# EAGLE design tesla_b (EAGLE 9.6.2)
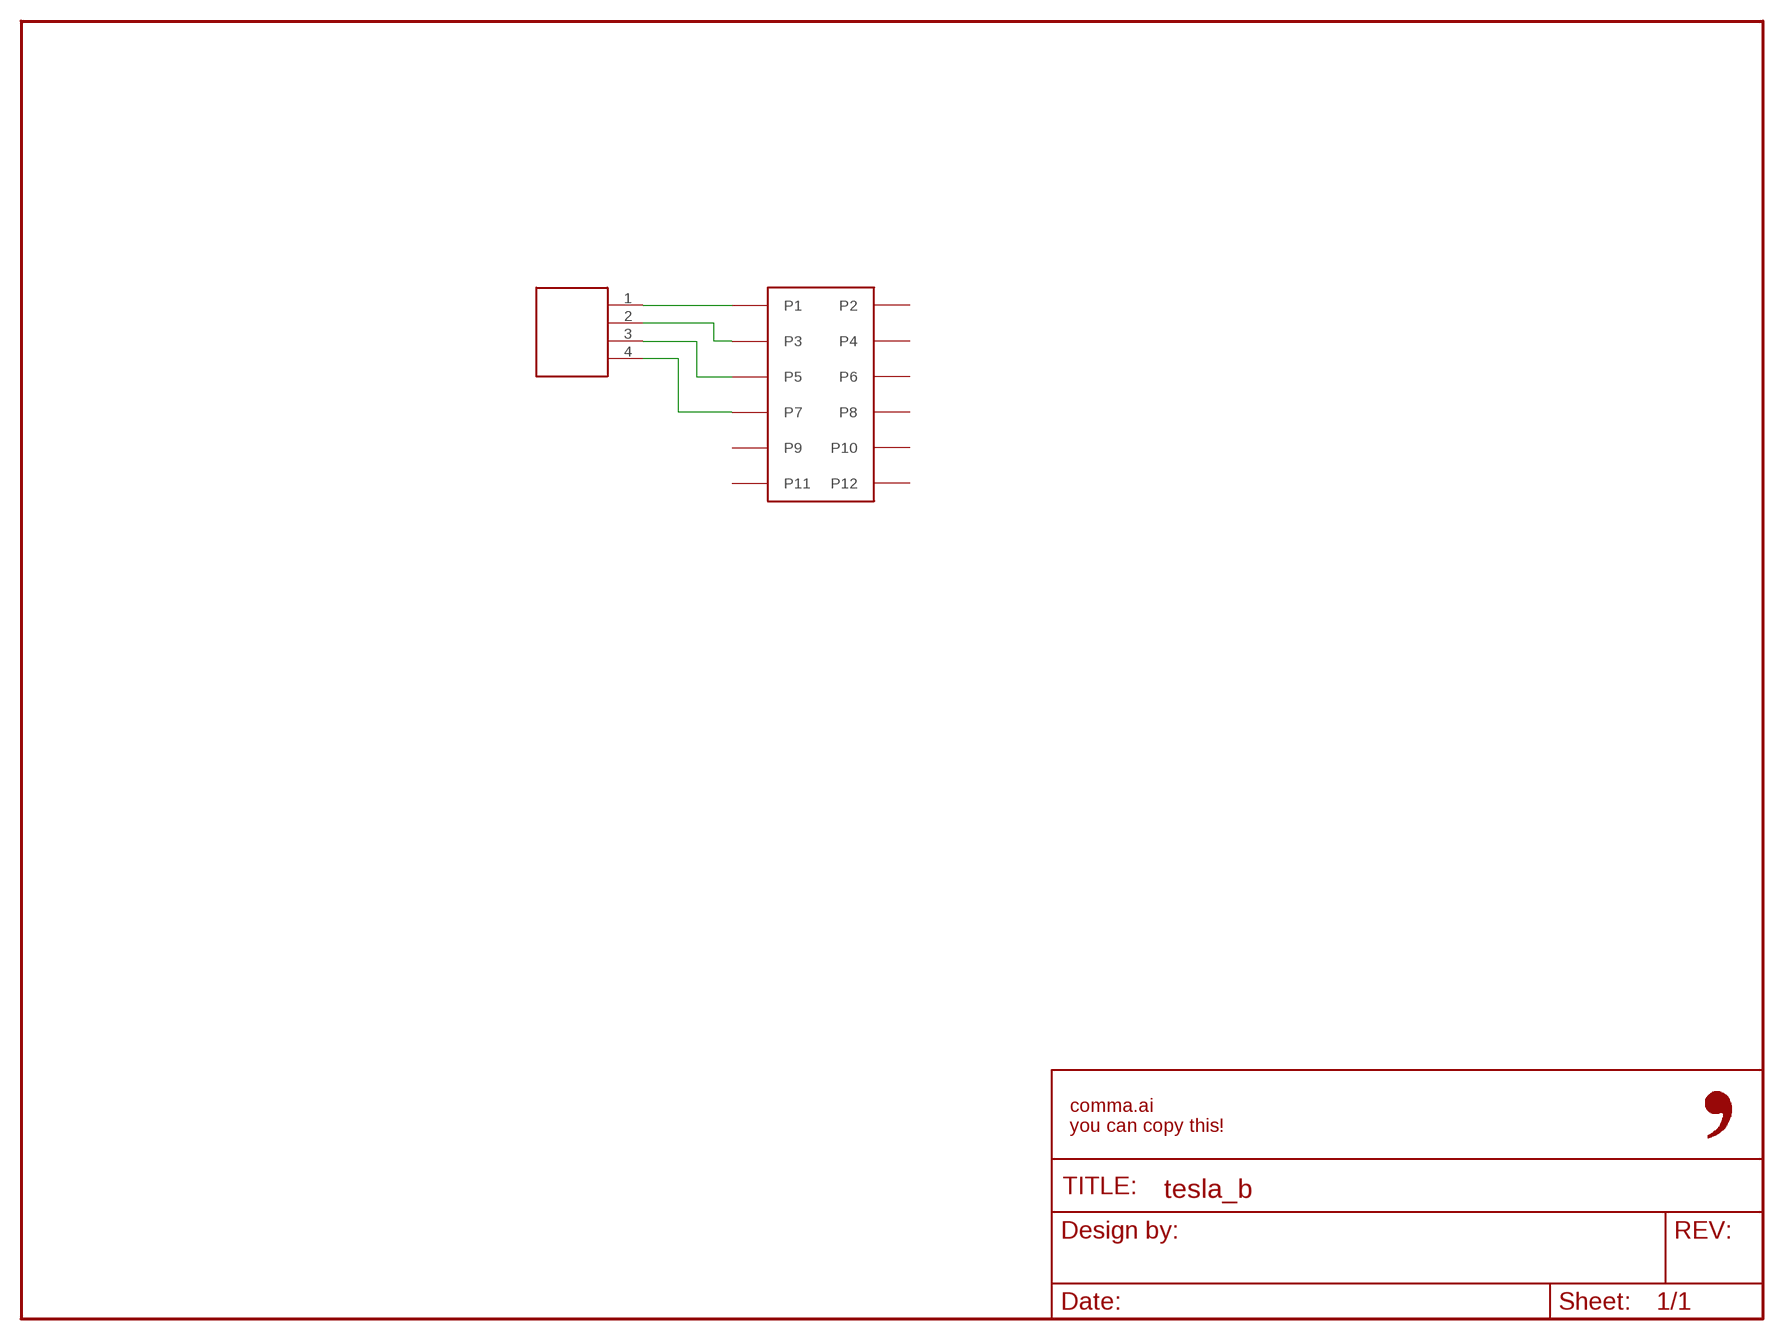
[diagram p0: schematic, sheet 1]

## Parts
FRAME1  FRAME-LETTER-OPENNO_PACKAGE  [DUMMY]
J1  5016451220  [5016451220]
J2  M04-641211-4  [641211-4]

## Nets
N$1: J1.P1 J2.1
N$2: J1.P3 J2.2
N$3: J1.P5 J2.3
N$4: J1.P7 J2.4
Unconnected: J1.P2 J1.P4 J1.P6 J1.P8 J1.P9 J1.P10 J1.P11 J1.P12

## Library data of the parts
FRAME1 = comma.ai:FRAME-LETTER-OPEN: Schematic Frame - Letter Standard 8.5x11 US Letter frame; DESIGNER: Nobody; VERSION: v01
J1 = comma.ai:5016451220; CPN: CAI-501645-1220
J2 = comma.ai:M04; CPN: CAI-2.54-4-HEADER-WIDE-BASE

## Board
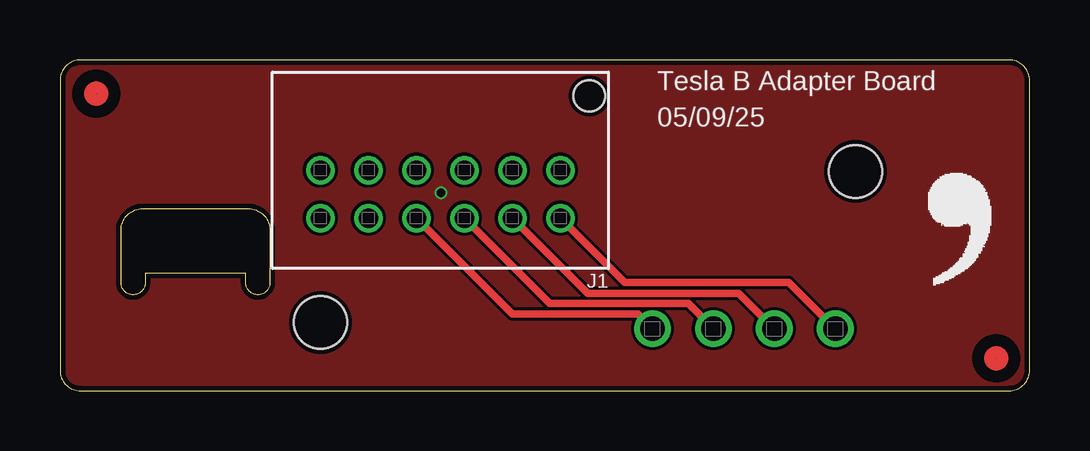
[diagram p1: board, top side]
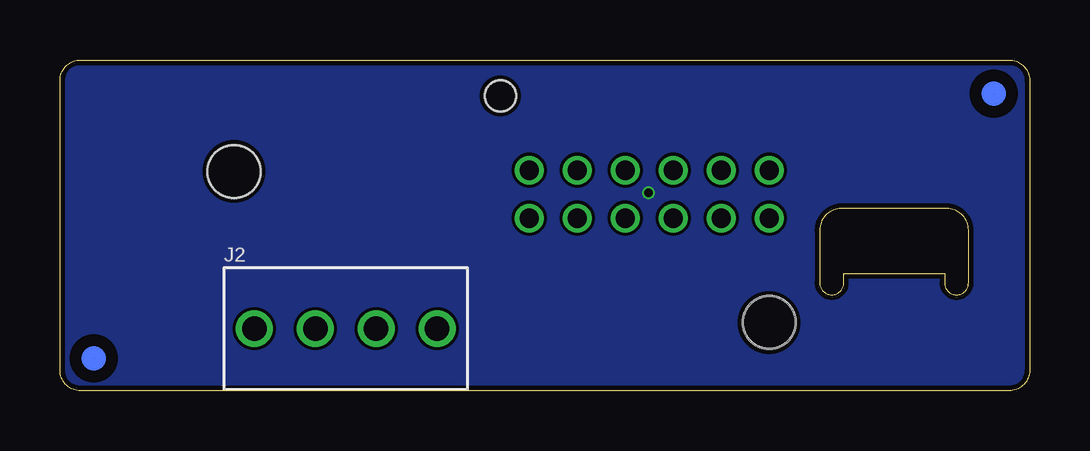
[diagram p2: board, bottom side, seen from below]

Size 40.4 x 13.8 mm. Coordinates in mm from the lower left corner, seen from the top.
Outline: 8.74,4.5 arc-180 7.74,4.5 7.74,4.9 3.54,4.9 3.54,4.5 arc-180 2.54,4.5 2.54,6.7 arc-90 3.44,7.6 7.84,7.6 arc-90 8.74,6.7 8.74,4.5
Outline: 0,0.85 arc90 0.85,0 39.55,0 arc90 40.4,0.85 40.4,12.95 arc90 39.55,13.8 0.85,13.8 arc90 0,12.95 0,0.85
Copper layers (1*16): Top 0.035mm / dielectric 1.5mm / Bottom 0.035mm
Design rules "jlcpcb_2layer": minimum track width 5mil, minimum drill 12mil, track to track 5mil, track to pad 5mil, pad to pad 5mil, via to via 5mil, smd to smd 5mil, copper to edge 8mil, drill to drill 8mil, minimum pad ring 3mil, minimum via ring 3mil, stop-mask expansion 4mm, vias tented up to drill 20mil, thermal gap 10mil
Holes 2.2 mm at 10.85,2.85 33.15,9.15

### Footprints (pad centres in the part's own frame; a part is rotated, then mirrored left to right if it is on the bottom)
5016451220 = drill 0.8: P1 -5,1; P2 -5,-1; P3 -3,1; P4 -3,-1; P5 -1,1; P6 -1,-1; P7 1,1; P8 1,-1; P9 3,1; P10 3,-1; P11 5,1; P12 5,-1 | hole 1.3: -6.2,-4.1
641211-4 = drill 1.02: 1 -3.81,0; 2 -1.27,0; 3 1.27,0; 4 3.81,0

### Placement (x,y rotation side)
FRAME1  0,0 0 top
J1  15.85,8.2 180 top
J2  28.49,2.59 0 bottom
U$1  [FIDUCIAL]  1.5,12.4 0 top
U$2  [FIDUCIAL]  39,1.35 0 top
U$3  [LOGO]  35.51,4.1 0 top

### Tracks (layer width: path | path; a pad name or v marks a point on that pad's centre or on a via)
GND  (via drill 0.35)
  other vias: 15.88,8.26
  pour Top: -1,15 42,15 42,-1 -1,-1
  pour Bottom: -2,16 43,16 43,-2 -2,-2
N$1
  Top 0.305: J2.1 30.37,4.52 23.53,4.52 J1.P1
N$2
  Top 0.305: J2.2 28.29,4.07 21.98,4.07 J1.P3
N$3
  Top 0.305: J2.3 26.18,3.63 20.41,3.63 J1.P5
N$4
  Top 0.305: J1.P7 18.85,3.2 24.07,3.2 J2.4

### Text on the board
tNames: Tesla B Adapter Board | 05/09/25